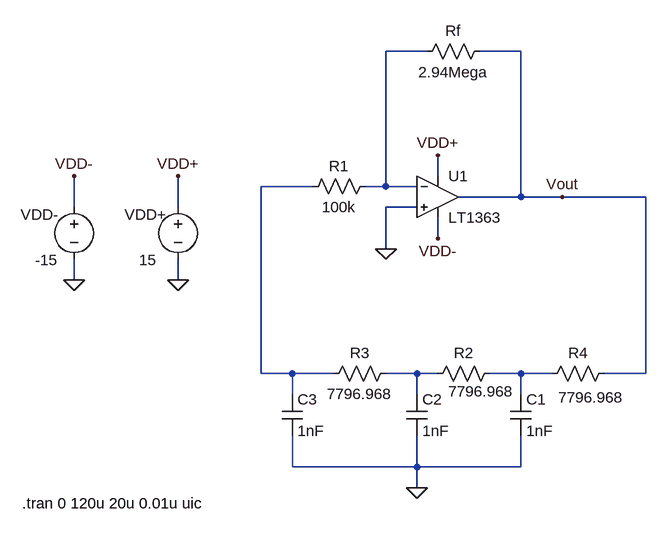
[diagram p0: schematic q1.asc]
q1.asc, the LTspice schematic file:
Version 4.1
SHEET 1 880 1044
WIRE 176 -64 112 -64
WIRE 320 -64 256 -64
WIRE 192 128 192 96
WIRE 0 144 -80 144
WIRE 112 144 112 -64
WIRE 112 144 80 144
WIRE 160 144 112 144
WIRE 320 160 320 -64
WIRE 320 160 224 160
WIRE 384 160 320 160
WIRE 512 160 384 160
WIRE -368 176 -368 128
WIRE -208 176 -208 128
WIRE 160 176 112 176
WIRE 192 224 192 192
WIRE 112 240 112 176
WIRE -368 288 -368 256
WIRE -208 288 -208 256
WIRE -80 432 -80 144
WIRE -32 432 -80 432
WIRE 32 432 -32 432
WIRE 160 432 112 432
WIRE 192 432 160 432
WIRE 320 432 272 432
WIRE 368 432 320 432
WIRE 512 432 512 160
WIRE 512 432 448 432
WIRE -32 464 -32 432
WIRE 160 464 160 432
WIRE 320 464 320 432
WIRE -32 576 -32 528
WIRE 160 576 160 528
WIRE 160 576 -32 576
WIRE 320 576 320 528
WIRE 320 576 160 576
WIRE 160 608 160 576
FLAG -368 288 0
FLAG 384 160 Vout
FLAG -208 288 0
FLAG -368 128 VDD-
FLAG -208 128 VDD+
FLAG 192 96 VDD+
FLAG 192 224 VDD-
FLAG 160 608 0
FLAG 112 240 0
SYMBOL voltage -368 160 R0
WINDOW 0 -82 27 Left 2
WINDOW 3 -60 97 Left 2
WINDOW 123 0 0 Left 0
WINDOW 39 0 0 Left 0
SYMATTR InstName VDD-
SYMATTR Value -15
SYMBOL voltage -208 160 R0
WINDOW 0 -82 27 Left 2
WINDOW 3 -60 97 Left 2
WINDOW 123 0 0 Left 0
WINDOW 39 0 0 Left 0
SYMATTR InstName VDD+
SYMATTR Value 15
SYMBOL res 464 416 R90
WINDOW 0 0 56 VBottom 2
WINDOW 3 37 36 VTop 2
SYMATTR InstName R4
SYMATTR Value 7796.968
SYMBOL cap 304 464 R0
SYMATTR InstName C1
SYMATTR Value 1nF
SYMBOL cap 144 464 R0
SYMATTR InstName C2
SYMATTR Value 1nF
SYMBOL res 288 416 R90
WINDOW 0 0 56 VBottom 2
WINDOW 3 28 29 VTop 2
SYMATTR InstName R2
SYMATTR Value 7796.968
SYMBOL res 128 416 R90
WINDOW 0 0 56 VBottom 2
WINDOW 3 32 56 VTop 2
SYMATTR InstName R3
SYMATTR Value 7796.968
SYMBOL cap -48 464 R0
SYMATTR InstName C3
SYMATTR Value 1nF
SYMBOL res 272 -80 R90
WINDOW 0 0 56 VBottom 2
WINDOW 3 32 56 VTop 2
SYMATTR InstName Rf
SYMATTR Value 2.94Mega
SYMBOL res 96 128 R90
WINDOW 0 0 56 VBottom 2
WINDOW 3 32 56 VTop 2
SYMATTR InstName R1
SYMATTR Value 100k
SYMBOL OpAmps\\LT1363 192 96 R0
SYMATTR InstName U1
TEXT -448 632 Left 2 !.tran 0 120u 20u 0.01u uic

The netlist it stands for:
* q1.asc
VDD- VDD- 0 -15
VDD+ VDD+ 0 15
R4 Vout N004 7796.968
C1 N004 0 1nF
C2 N003 0 1nF
R2 N004 N003 7796.968
R3 N003 N002 7796.968
C3 N002 0 1nF
Rf Vout N001 2.94Mega
R1 N001 N002 100k
X§U1 0 N001 VDD+ VDD- Vout LT1363  ; pins In+ In- V+ V- OUT
.tran 0 120u 20u 0.01u uic
.lib LT1363.sub
.backanno
.end

* Results of the author's LTspice run, read from the files saved beside the schematic
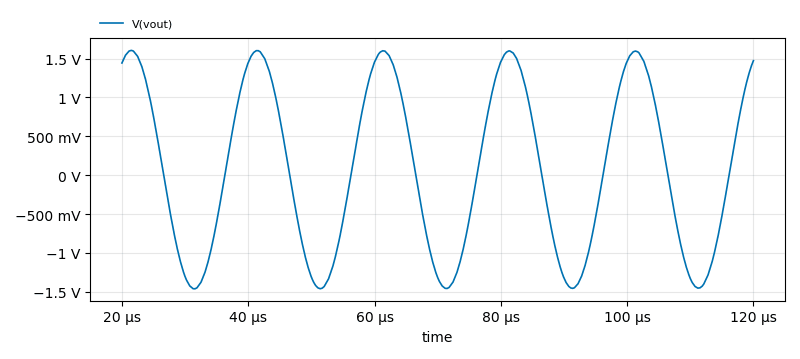
[diagram p1: Transient Analysis of q1.asc, plotted from the saved traces]
* Transient Analysis, 1 run:
*   V(vout): min -1.462 V, max 1.606 V, average 73.82 mV, rms 1.084 V, last 1.473 V